# EAGLE schematic schema_v3_2_SMD_DIP (EAGLE 6.2)
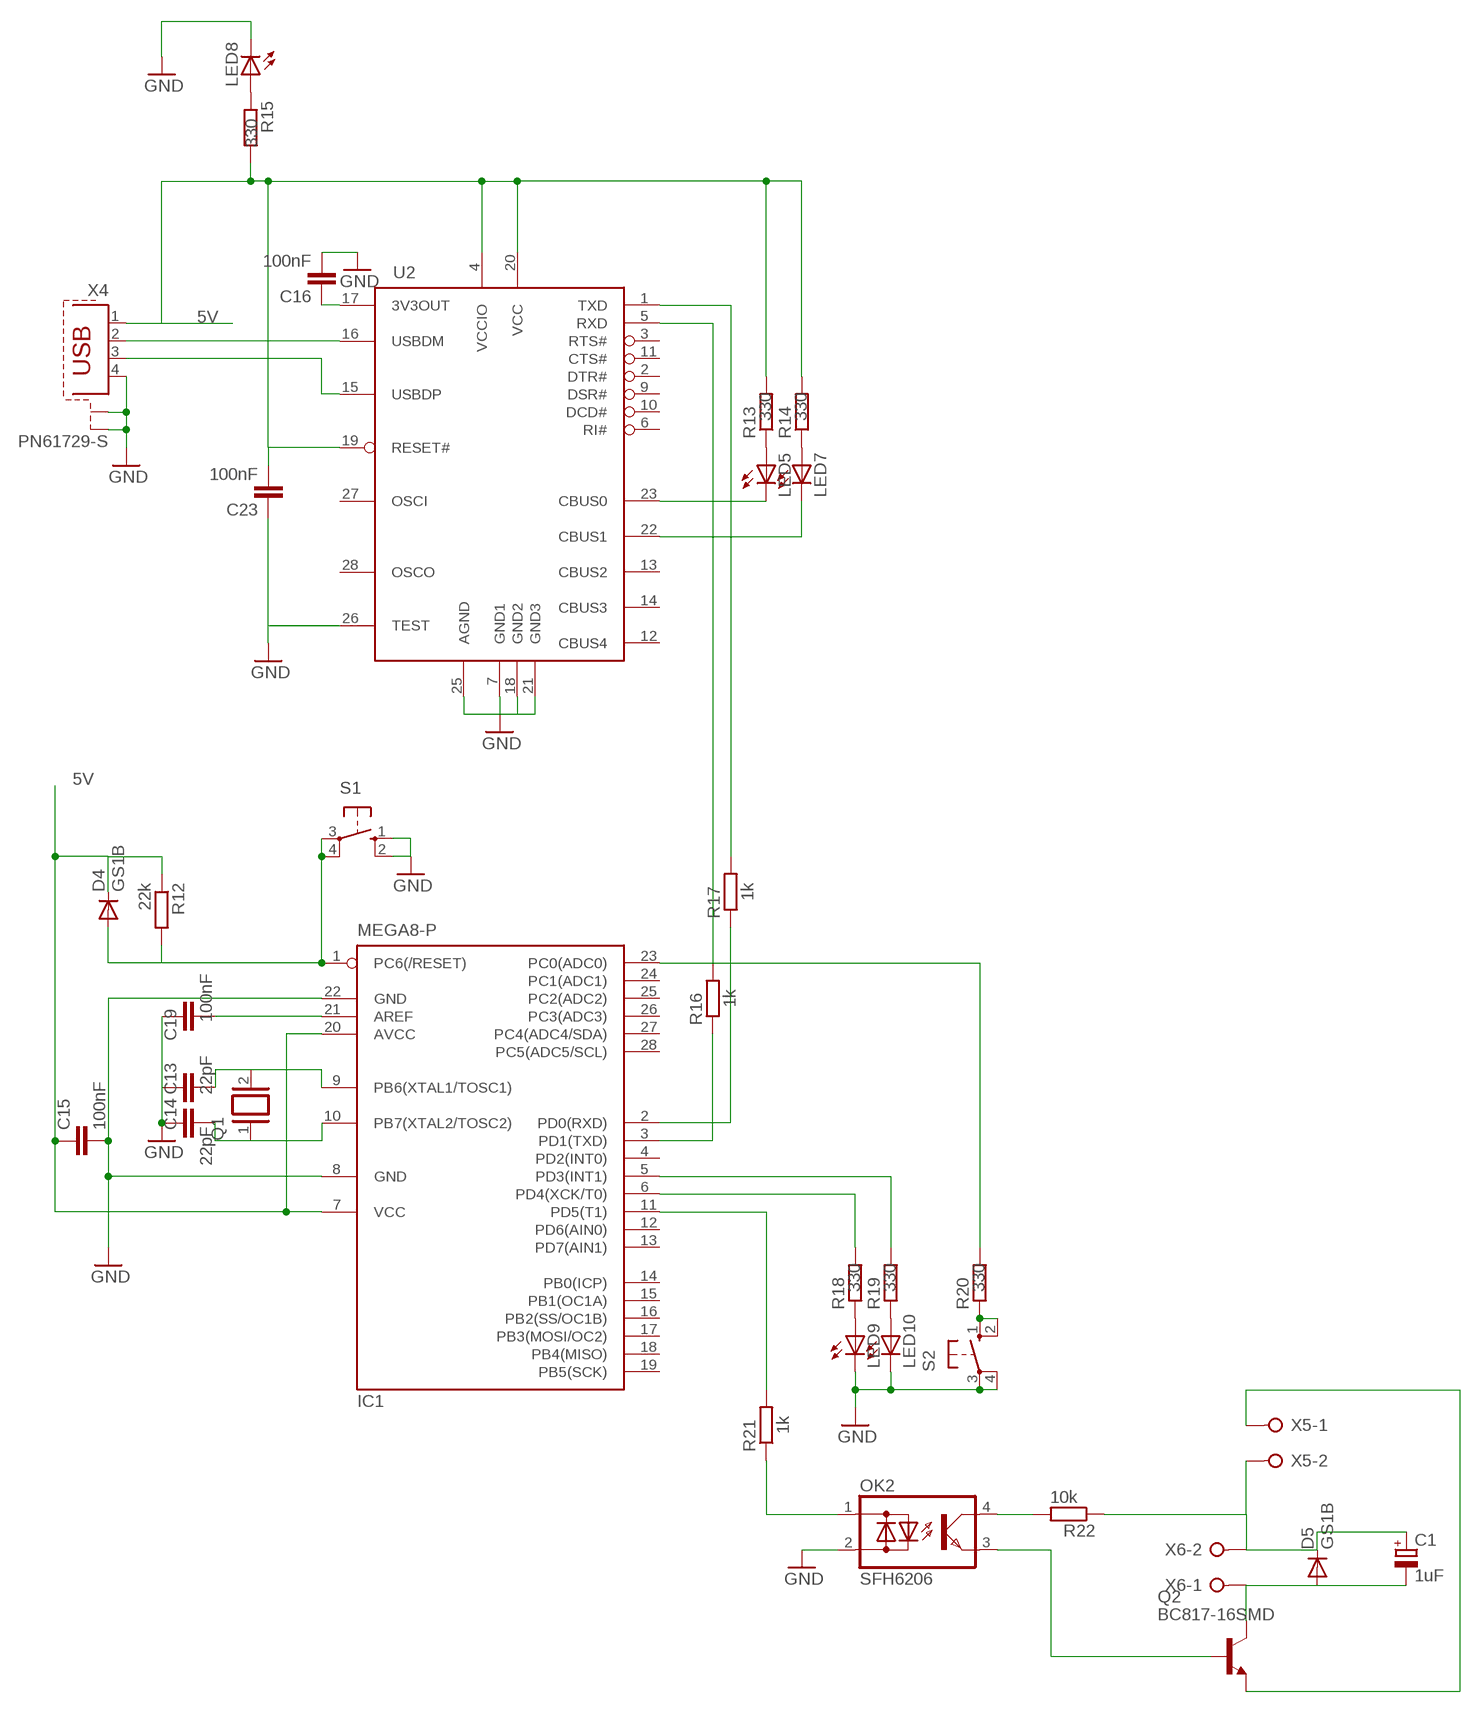
[diagram p0: schematic, sheet 1]

## Parts
C1  1uF  CPOL-EUE2.5-5  [E2,5-5]
C13  22pF  C-EUC0805  [C0805]
C14  22pF  C-EUC0805  [C0805]
C15  100nF  C-EUC0805  [C0805]
C16  100nF  C-EUC0805  [C0805]
C19  100nF  C-EUC0805  [C0805]
C23  100nF  C-EUC0805  [C0805]
D4  GS1B  DIODE-DO214AC  [DO214AC]
D5  GS1B  DIODE-DO214AC  [DO214AC]
IC1  MEGA8-P  [DIL28-3]
LED5  LEDSMT1206  [1206]
LED7  LEDSMT1206  [1206]
LED8  LEDSMT1206  [1206]
LED9  LEDSMT1206  [1206]
LED10  LEDSMT1206  [1206]
OK2  SFH6206  [DIL4-SMD]
Q1  XTAL  [Q]
Q2  BC817-16SMD  [SOT23-BEC]
R12  22k  R-EU_R0805  [R0805]
R13  330  R-EU_R0805  [R0805]
R14  330  R-EU_R0805  [R0805]
R15  330  R-EU_R0805  [R0805]
R16  1k  R-EU_R0805  [R0805]
R17  1k  R-EU_R0805  [R0805]
R18  330  R-EU_R0805  [R0805]
R19  330  R-EU_R0805  [R0805]
R20  330  R-EU_R0805  [R0805]
R21  1k  R-EU_R0805  [R0805]
R22  10k  R-EU_R0805  [R0805]
S1  10-XX  [B3F-10XX]
S2  10-XX  [B3F-10XX]
U2  FT232RL  [SSOP28DB]
X4  PN61729-S  [PN61729-S]
X5  W237-02P  [W237-132]
X6  W237-02P  [W237-132]

## Nets
5V: C15.1 C23.2 D4.C IC1.7(VCC) IC1.20(AVCC) R12.1 R13.2 R14.2 R15.2 U2.4(VCCIO) U2.19(RESET#) U2.20(VCC) X4.1
GND: C13.1 C14.1 C15.2 C16.2 C19.2 C23.1 IC1.8(GND) IC1.22(GND) LED8.C LED9.C LED10.C OK2.2(AC2) S1.1(S) S1.2(S1) S2.3(P) S2.4(P1) U2.26(TEST) X4.4 X4.S1 X4.S2
N$1: IC1.3(PD1(TXD)) R16.1
N$2: IC1.2(PD0(RXD)) R17.1
N$3: C19.1 IC1.21(AREF)
N$4: C14.2 IC1.10(PB7(XTAL2/TOSC2)) Q1.1
N$5: C13.2 IC1.9(PB6(XTAL1/TOSC1)) Q1.2
N$38: D4.A IC1.1(PC6(/RESET)) R12.2 S1.3(P) S1.4(P1)
N$39: LED5.A R13.1
N$40: LED7.A R14.1
N$41: LED5.C U2.23(CBUS0)
N$42: LED7.C U2.22(CBUS1)
N$43: R16.2 U2.5(RXD)
N$44: R17.2 U2.1(TXD)
N$45: R20.1 S2.1(S) S2.2(S1)
N$46: IC1.6(PD4(XCK/T0)) R18.2
N$48: U2.16(USBDM) X4.2
N$49: U2.15(USBDP) X4.3
N$50: IC1.5(PD3(INT1)) R19.2
N$51: LED8.A R15.1
N$52: IC1.23(PC0(ADC0)) R20.2
N$96: C16.1 U2.17(3V3OUT)
N$97: LED9.A R18.1
N$98: LED10.A R19.1
N$101: OK2.3(E) Q2.B
N$102: OK2.1(AC1) R21.1
N$103: IC1.11(PD5(T1)) R21.2
N$104: OK2.4(C) R22.2
N$105: C1.+ D5.C R22.1 X5.2 X6.2
N$106: C1.- D5.A Q2.C X6.1
N$107: Q2.E X5.1
Unconnected: IC1.4(PD2(INT0)) IC1.12(PD6(AIN0)) IC1.13(PD7(AIN1)) IC1.14(PB0(ICP)) IC1.15(PB1(OC1A)) IC1.16(PB2(SS/OC1B)) IC1.17(PB3(MOSI/OC2)) IC1.18(PB4(MISO)) IC1.19(PB5(SCK)) IC1.24(PC1(ADC1)) IC1.25(PC2(ADC2)) IC1.26(PC3(ADC3)) IC1.27(PC4(ADC4/SDA)) IC1.28(PC5(ADC5/SCL)) U2.2(DTR#) U2.3(RTS#) U2.6(RI#) U2.9(DSR#) U2.10(DCD#) U2.11(CTS#) U2.12(CBUS4) U2.13(CBUS2) U2.14(CBUS3) U2.27(OSCI) U2.28(OSCO)

## Power pins joined to a net without a drawn wire
AGND: U2.25(AGND)
GND1: U2.7(GND1)
GND2: U2.18(GND2)
GND3: U2.21(GND3)

## Library data of the parts
C1 = rcl:CPOL-EU: POLARIZED CAPACITOR, European symbol
C13-C16 C19 C23 = rcl:C-EU: CAPACITOR, European symbol
D4 D5 = diode:DIODE-: DIODE
IC1 = atmel:MEGA8-P: MICROCONTROLLER 8 Kbytes FLASH, 1 kbytes SRAM, 512 bytes EEPROM, USART, 4-channel 10 bit ADC, 2-channel 8 bit ADC Pin compatible with Atmega48, ATMega88, ATMega168 Source: avr.lbr; OC_FARNELL: unknown; OC_NEWARK: unknown
LED5 LED7-LED10 = led:LED: LED OSRAM: - CHIPLED LG R971, LG N971, LY N971, LG Q971, LY Q971, LO R971, LY R971 LH N974, LH R974 LS Q976, LO Q976, LY Q976 LO Q996 - Hyper CHIPLED LW Q18S LB Q993, LB Q99A, LB R99A - SideLED LS A670, LO A670, LY A670, LG A670, LP A670 LB A673, LV A673, LT A673, LW A673 LH A674 LY A675 LS A676, LA A676, LO A676, LY A676, LW A676 LS A679, LY A679, LG A679 - Hyper Micro SIDELED® LS Y876, LA Y876, LO Y876, LY Y876 LT Y87S - SmartLED LW L88C, LW L88S LB L89C, LB L89S, LG L890 LS L89K, LO L89K, LY L89K LS L896, LA L896, LO L896, LY L896 - TOPLED LS T670, LO T670, LY T670, LG T670, LP T670 LSG T670, LSP T670, LSY T670, LOP T670, LYG T670 LG T671, LOG T671, LSG T671 LB T673, LV T673, LT T673, LW T673 LH T674 LS T676, LA T676, LO T676, LY T676, LB T676, LH T676, LSB T676, LW T676 LB T67C, LV T67C, LT T67C, LS T67K, LO T67K, LY T67K, LW E67C LS E67B, LA E67B, LO E67B, LY E67B, LB E67C, LV E67C, LT E67C LW T67C LS T679, LY T679, LG T679 LS T770, LO T770, LY T770, LG T770, LP T770 LB T773, LV T773, LT T773, LW T773 LH T774 LS E675, LA E675, LY E675, LS T675 LS T776, LA T776, LO T776, LY T776, LB T776 LHGB T686 LT T68C, LB T68C - Hyper Mini TOPLED® LB M676 - Mini TOPLED Santana® LG M470 LS M47K, LO M47K, LY M47K Source: http://www.osram.convergy.de LUXEON: - LUMILED® LXK2-PW12-R00, LXK2-PW12-S00, LXK2-PW14-U00, LXK2-PW14-V00 LXK2-PM12-R00, LXK2-PM12-S00, LXK2-PM14-U00 LXK2-PE12-Q00, LXK2-PE12-R00, LXK2-PE12-S00, LXK2-PE14-T00, LXK2-PE14-U00 LXK2-PB12-K00, LXK2-PB12-L00, LXK2-PB12-M00, LXK2-PB14-N00, LXK2-PB14-P00, LXK2-PB14-Q00 LXK2-PR12-L00, LXK2-PR12-M00, LXK2-PR14-Q00, LXK2-PR14-R00 LXK2-PD12-Q00, LXK2-PD12-R00, LXK2-PD12-S00 LXK2-PH12-R00, LXK2-PH12-S00 LXK2-PL12-P00, LXK2-PL12-Q00, LXK2-PL12-R00 Source: www.luxeon.com KINGBRIGHT: KA-3528ASYC Source: www.kingbright.com
OK2 = optocoupler:SFH620: Optocoupler, Phototransistor Output, AC Input Source: http://www.vishay.com/docs/83675/sfh620.pdf; MF: VISHAY/TELEFUNKEN; MPN: SFH6206-3; OC_FARNELL: 1469585; OC_NEWARK: 58K2214
Q1 = special:XTAL: CRYSTAL
Q2 = transistor-npn:BC817*: NPN Transistor
R12-R22 = rcl:R-EU_: RESISTOR, European symbol
S1 S2 = switch-omron:10-XX: OMRON SWITCH; MPN: B3F-1000; OC_FARNELL: 176432; OC_NEWARK: 36M3542
U2 = ftdichip-5:FT232RL: USB UART 4th Generation USB UART (USB <-> Serial) Controller
X4 = con-berg:PN61729-S: BERG USB connector; OC_FARNELL: unknown; OC_NEWARK: unknown
X5 X6 = con-wago-508:W237-02P: WAGO SREW CLAMP; OC_FARNELL: unknown; OC_NEWARK: unknown

## Net classes
0 default: width 0.203 mm